# EAGLE schematic engmon-wroom (EAGLE 9.6.2)
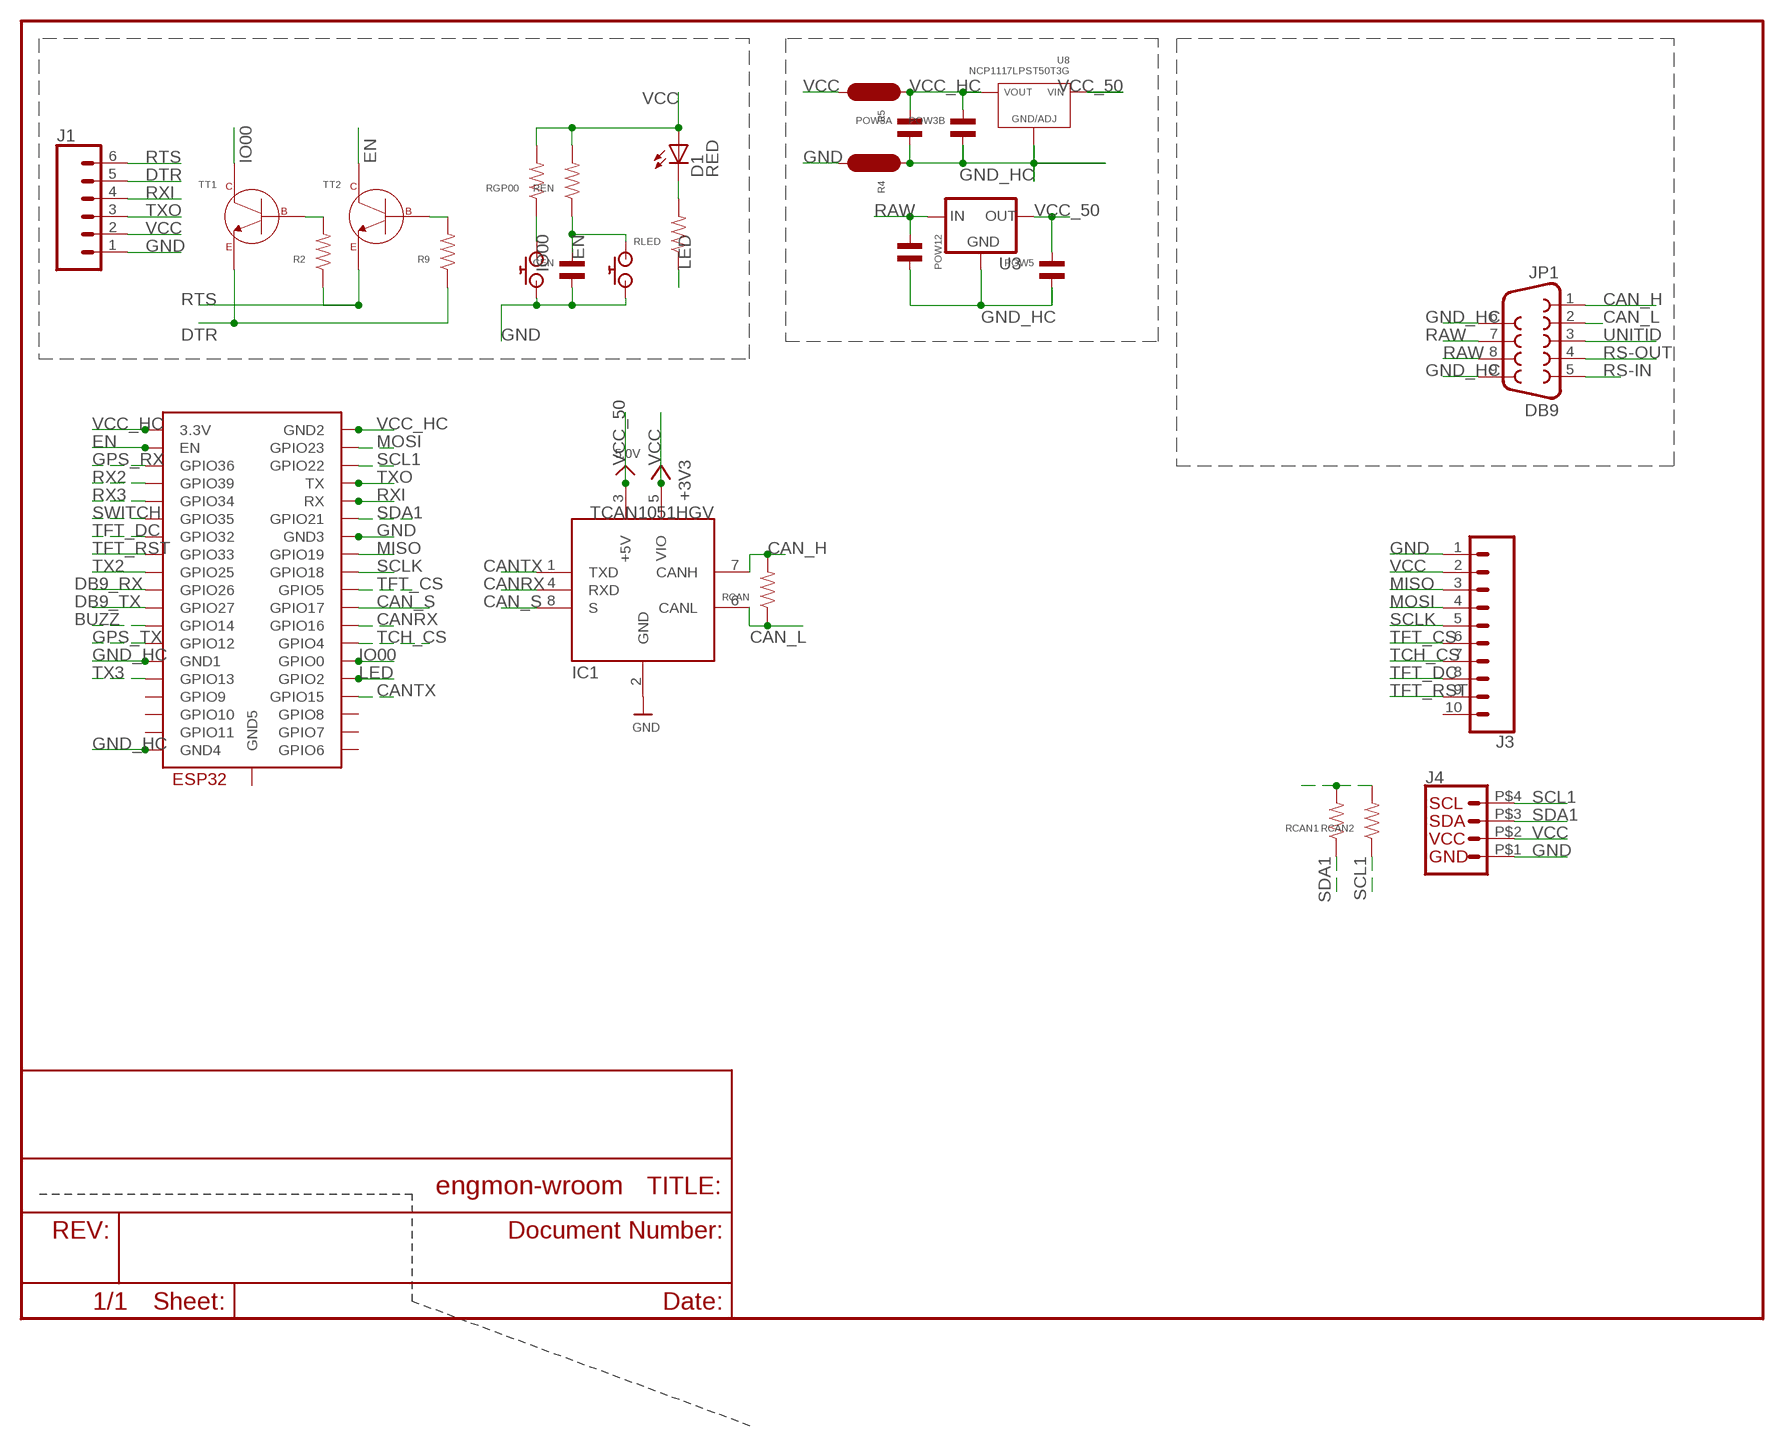
[diagram p0: schematic, sheet 1]

## Parts
CEN  CAPACITOR_NP_0603  [C0603]
D1  RED  LED-RED0603  [LED-0603]
IC1  TCAN1051HGV  CAN_TRANSCIEVER_TCAN1051V  [SOIC8_150MIL]
J1  CONN_06  [1X6-1.25MM-SMD]
J3  CONN_10  [1X10-1.25MM]
J4  Vertical Qwiic Connector  QWIIC_CONNECTORJST04_1MM_HOLE  [JST04_1MM_HOLES]
JP1  DB9  DB9FEMALE  [DB9]
POW3A  CAPACITOR_NP_0603  [C0603]
POW3B  CAPACITOR_NP_0603  [C0603]
POW5  CAPACITOR_NP_0603  [C0603]
POW12  CAPACITOR_NP_0603  [C0603]
R2  RESISTOR_0603  [R0603]
R4  JUMPER  [R0603_JMP]
R5  JUMPER  [R0603_JMP]
R9  RESISTOR_0603  [R0603]
RCAN  RESISTOR_0603  [R0603]
RCAN1  RESISTOR_0603  [R0603]
RCAN2  RESISTOR_0603  [R0603]
REN  RESISTOR_0603  [R0603]
RGP00  RESISTOR_0603  [R0603]
RLED  RESISTOR_0603  [R0603]
TT1  MF-DSC-SOT233-MMBT3904  NPN_BJTMMBT3904_SOT-23-3  [SOT-23-3]
TT2  MF-DSC-SOT233-MMBT3904  NPN_BJTMMBT3904_SOT-23-3  [SOT-23-3]
U3  V_REG_78XXSINK  [TO220-IGO]
U8  NCP1117LPST50T3G  [SOT-223-3]
U$1  AMAZON_BUTTONB2010  [C2010]
U$2  AMAZON_BUTTONB2010  [C2010]
U$3  ESP32-WROOM  [ESP32-WROOM]

## Nets
BUZZ: U$3.IO14(GPIO14)
CAN_H: IC1.7(CANH) JP1.1 RCAN.P$2
CAN_L: IC1.6(CANL) JP1.2 RCAN.P$1
CAN_S: IC1.8(S) U$3.IO17(GPIO17)
CANRX: IC1.4(RXD) U$3.IO16(GPIO16)
CANTX: IC1.1(TXD) U$3.IO15(GPIO15)
DB9_RX: U$3.IO26(GPIO26)
DB9_TX: U$3.IO27(GPIO27)
DTR: J1.5 R9.P$1 TT1.P$2(EMITTER)
EN: CEN.P$1 REN.P$1 TT2.P$3(COLLECTOR) U$2.P$1 U$3.EN
GND: CEN.P$2 IC1.2(GND) J1.1 J3.1 J4.P$1 R4.P$2 U$1.P$2 U$2.P$2 U$3.GND3
GND_HC [hc]: JP1.6 JP1.9 POW3A.P$2 POW3B.P$2 POW5.P$2 POW12.P$2 R4.P$1 U3.GND U8.P$2(GND/ADJ) U$3.GND1 U$3.GND4
GPS_RX: U$3.SENSOR_VP(GPIO36)
GPS_TX: U$3.IO12(GPIO12)
IO00: RGP00.P$1 TT1.P$3(COLLECTOR) U$1.P$1 U$3.IO0(GPIO0)
LED: RLED.P$1 U$3.IO2(GPIO2)
MISO: J3.3 U$3.IO19(GPIO19)
MOSI: J3.4 U$3.IO23(GPIO23)
N$2: D1.C RLED.P$2
N$3: R2.P$2 TT1.P$1(BASE)
N$6: R9.P$2 TT2.P$1(BASE)
RAW [hc]: JP1.7 JP1.8 POW12.P$1 U3.IN
RS-IN: JP1.5
RS-OUT: JP1.4
RTS: J1.6 R2.P$1 TT2.P$2(EMITTER)
RX2: U$3.SENSOR_VN(GPIO39)
RX3: U$3.IO34(GPIO34)
RXI: J1.4 U$3.RX
SCL1: J4.P$4 RCAN2.P$1 U$3.IO22(GPIO22)
SCLK: J3.5 U$3.IO18(GPIO18)
SDA1: J4.P$3 RCAN1.P$1 U$3.IO21(GPIO21)
SWITCH: U$3.IO35(GPIO35)
TCH_CS: J3.7 U$3.IO4(GPIO4)
TFT_CS: J3.6 U$3.IO5(GPIO5)
TFT_DC: J3.8 U$3.IO32(GPIO32)
TFT_RST: J3.9 U$3.IO33(GPIO33)
TX2: U$3.IO25(GPIO25)
TX3: U$3.IO13(GPIO13)
TXO: J1.3 U$3.TX
UNITID: JP1.3
VCC: D1.A IC1.5(VIO) J1.2 J3.2 J4.P$2 R5.P$2 RCAN1.P$2 RCAN2.P$2 REN.P$2 RGP00.P$2 ; supply symbol labelled +3V3
VCC_50 [hc]: IC1.3(+5V) POW5.P$1 U3.OUT U8.P$4(VIN) ; supply symbol labelled 5.0V
VCC_HC [hc]: POW3A.P$1 POW3B.P$1 R5.P$1 U8.P$1(VOUT) U8.P$3(VOUT) U$3.3V3(3.3V) U$3.GND2
Unconnected: J3.10 U$3.CLK(GPIO6) U$3.CMD(GPIO11) U$3.GND5 U$3.SD0(GPIO7) U$3.SD1(GPIO8) U$3.SD2(GPIO9) U$3.SD3(GPIO10)

## Library data of the parts
CEN POW3A POW3B POW5 POW12 = MF_Passives:CAPACITOR_NP: Library: MF_Passives Description: Device for Non-Polarized Capacitors. Manufacture part number (MPN) can be added via Attributes. Check https://factory.macrofab.com/parts for the house parts list.; POPULATE: 1
D1 = 00jim:LED-RED: Assorted Red LEDs LilyPad 1206- DIO-09912 1206- DIO-00809 0603- DIO-00819; PROD_ID: DIO-00819
IC1 = microbuilder:CAN_TRANSCIEVER
J1 = 00jim:CONN_06: Multi connection point. Often used as Generic Header-pin footprint for 0.1 inch spaced/style header connections On any of the 0.1 inch spaced packages, you can populate with these: Break Away Headers - Straight <https://www.sparkfun.com/products/116> (PRT-00116) Break Away Male Headers - Right Angle <https://www.sparkfun.com/products/553> (PRT-00553) Female Headers <https://www.sparkfun.com/products/115> (PRT-00115) Break Away Headers - Machine Pin <https://www.sparkfun.com/products/117> (PRT-00117) Break Away Female Headers - Swiss Machine Pin <https://www.sparkfun.com/products/743> (PRT-00743) Arduino Stackable Header - 6 Pin <https://www.sparkfun.com/products/9280> (PRT-09280) For SCREWTERMINALS and SPRING TERMINALS visit here: Screw Terimnals on SparkFun.com <https://www.sparkfun.com/search/results?term=Screw+Terminals> (5mm/3.5mm/2.54mm spacing) This device is also useful as a general connection point to wire up your design to another part of your project. Our various solder wires solder well into these plated through hole pads. Hook-Up Wire - Assortment (Stranded, 22 AWG) <https://www.sparkfun.com/products/11375> (PRT-11375) Hook-Up Wire - Assortment (Solid Core, 22 AWG) <https://www.sparkfun.com/products/11367> (PRT-11367) View the entire wire category on our website here <https://www.sparkfun.com/categories/141>
J3 = SparkFun-Connectors:CONN_10: Multi connection point. Often used as Generic Header-pin footprint for 0.1 inch spaced/style header connections On any of the 0.1 inch spaced packages, you can populate with these: Break Away Headers - Straight <https://www.sparkfun.com/products/116> (PRT-00116) Break Away Male Headers - Right Angle <https://www.sparkfun.com/products/553> (PRT-00553) Female Headers <https://www.sparkfun.com/products/115> (PRT-00115) Break Away Headers - Machine Pin <https://www.sparkfun.com/products/117> (PRT-00117) Break Away Female Headers - Swiss Machine Pin <https://www.sparkfun.com/products/743> (PRT-00743) Arduino Stackable Header - 10 Pin <https://www.sparkfun.com/products/11376> (PRT-11376) For SCREWTERMINALS and SPRING TERMINALS visit here: Screw Terimnals on SparkFun.com <https://www.sparkfun.com/search/results?term=Screw+Terminals> (5mm/3.5mm/2.54mm spacing) This device is also useful as a general connection point to wire up your design to another part of your project. Our various solder wires solder well into these plated through hole pads. Hook-Up Wire - Assortment (Stranded, 22 AWG) <https://www.sparkfun.com/products/11375> (PRT-11375) Hook-Up Wire - Assortment (Solid Core, 22 AWG) <https://www.sparkfun.com/products/11367> (PRT-11367) View the entire wire category on our website here <https://www.sparkfun.com/categories/141> Special notes: Molex polarized connector foot print use with SKU : PRT-08231 with associated crimp pins and housings. 1MM SMD Version SKU: PRT-10208 NOTES ON THE VARIANTS LOCK and LOCK_LONGPADS... This footprint was designed to help hold the alignment of a through-hole component (i.e. 6-pin header) while soldering it into place. You may notice that each hole has been shifted either up or down by 0.005 of an inch from it's more standard position (which is a perfectly straight line). This slight alteration caused the pins (the squares in the middle) to touch the edges of the holes. Because they are alternating, it causes a "brace" to hold the component in place. 0.005 has proven to be the perfect amount of "off-center" position when using our standard breakaway headers. Although looks a little odd when you look at the bare footprint, once you have a header in there, the alteration is very hard to notice. Also,if you push a header all the way into place, it is covered up entirely on the bottom side.
J4 = 00jim:QWIIC_CONNECTOR: SparkFun I2C Standard Qwiic Connector An SMD 1mm pitch JST connector makes it easy and quick (get it? Qwiic?) to connect I2C devices to each other. The Qwiic system <http://www.sparkfun.com/qwiic> enables fast and solderless connection between popular platforms and various sensors and actuators. We carry 200mm <https://www.sparkfun.com/products/14204>, 100mm <https://www.sparkfun.com/products/14205>, 50mm <https://www.sparkfun.com/products/14206>, and breadboard friendly <https://www.sparkfun.com/products/14207> Qwiic cables. We also offer 10 pcs strips <https://www.sparkfun.com/products/14323> the SMD connectors.
JP1 = SparkFun-Connectors:DB9: DB9 Connector Standard DB9 (D-Sub 9) serial connector. Can be used for CAN bus as well as RS485 and RS232. Footprint production proven. Spark Fun Electronics SKU : PRT-00429; PROD_ID: CONN-08194
R2 R9 RCAN RCAN1 RCAN2 REN RGP00 RLED = 00jim:RESISTOR: Library: MF_Passives Description: Device for Resistors. Manufacture part number (MPN), Voltage, Tolerance, and Wattage Rating can be added via Attributes. Check https://factory.macrofab.com/parts for the house parts list.; POPULATE: 1
R4 R5 = 00jim:JUMPER: Library: MF_Passives Description: Device for Resistors. Manufacture part number (MPN), Voltage, Tolerance, and Wattage Rating can be added via Attributes. Check https://factory.macrofab.com/parts for the house parts list.
TT1 TT2 = MF_Discrete_Semiconductor:NPN_BJT: Library: MF_Discrete_Semiconductor Description: Device for Single NPN BJT Transistors. Manufacture part number (MFG#) can be added via Attributes.; HOUSEPART: YES; MPN: MF-DSC-SOT233-MMBT3904; POPULATE: 1; URL: https://factory.macrofab.com/part/MF-DSC-SOT233-MMBT3904
U3 = SparkFun-IC-Power:V_REG_78XX: Voltage Regulator Standard 78xx regulator. IGO (Input Ground Output). Spark Fun Electronics SKU : COM-00107
U8 = MF_IC_Power:NCP1117LP: Manufacturer Part #: NCP1117LP Manufacturer: ON Semiconductor Description: LDO Voltage Regulators; HOUSEPART: NO; MPN: NCP1117LPST50T3G; POPULATE: 1; URL: http://www.onsemi.com/pub_link/Collateral/NCP1117LP-D.PDF
U$1 U$2 = 00jim:AMAZON_BUTTON
U$3 = ESP32:ESP32-WROOM

## Net classes
0 default: width 0.229 mm
1 vcc: width 0.254 mm
3 hc: width 0.508 mm